# EAGLE design module_connector (EAGLE 9.6.2)
AUTHOR: Mike Schmidt; GENERATION: pasta; TITLE: Module Connector; VERSION: 04

## Sheet 1 of 2: Interface Connectors
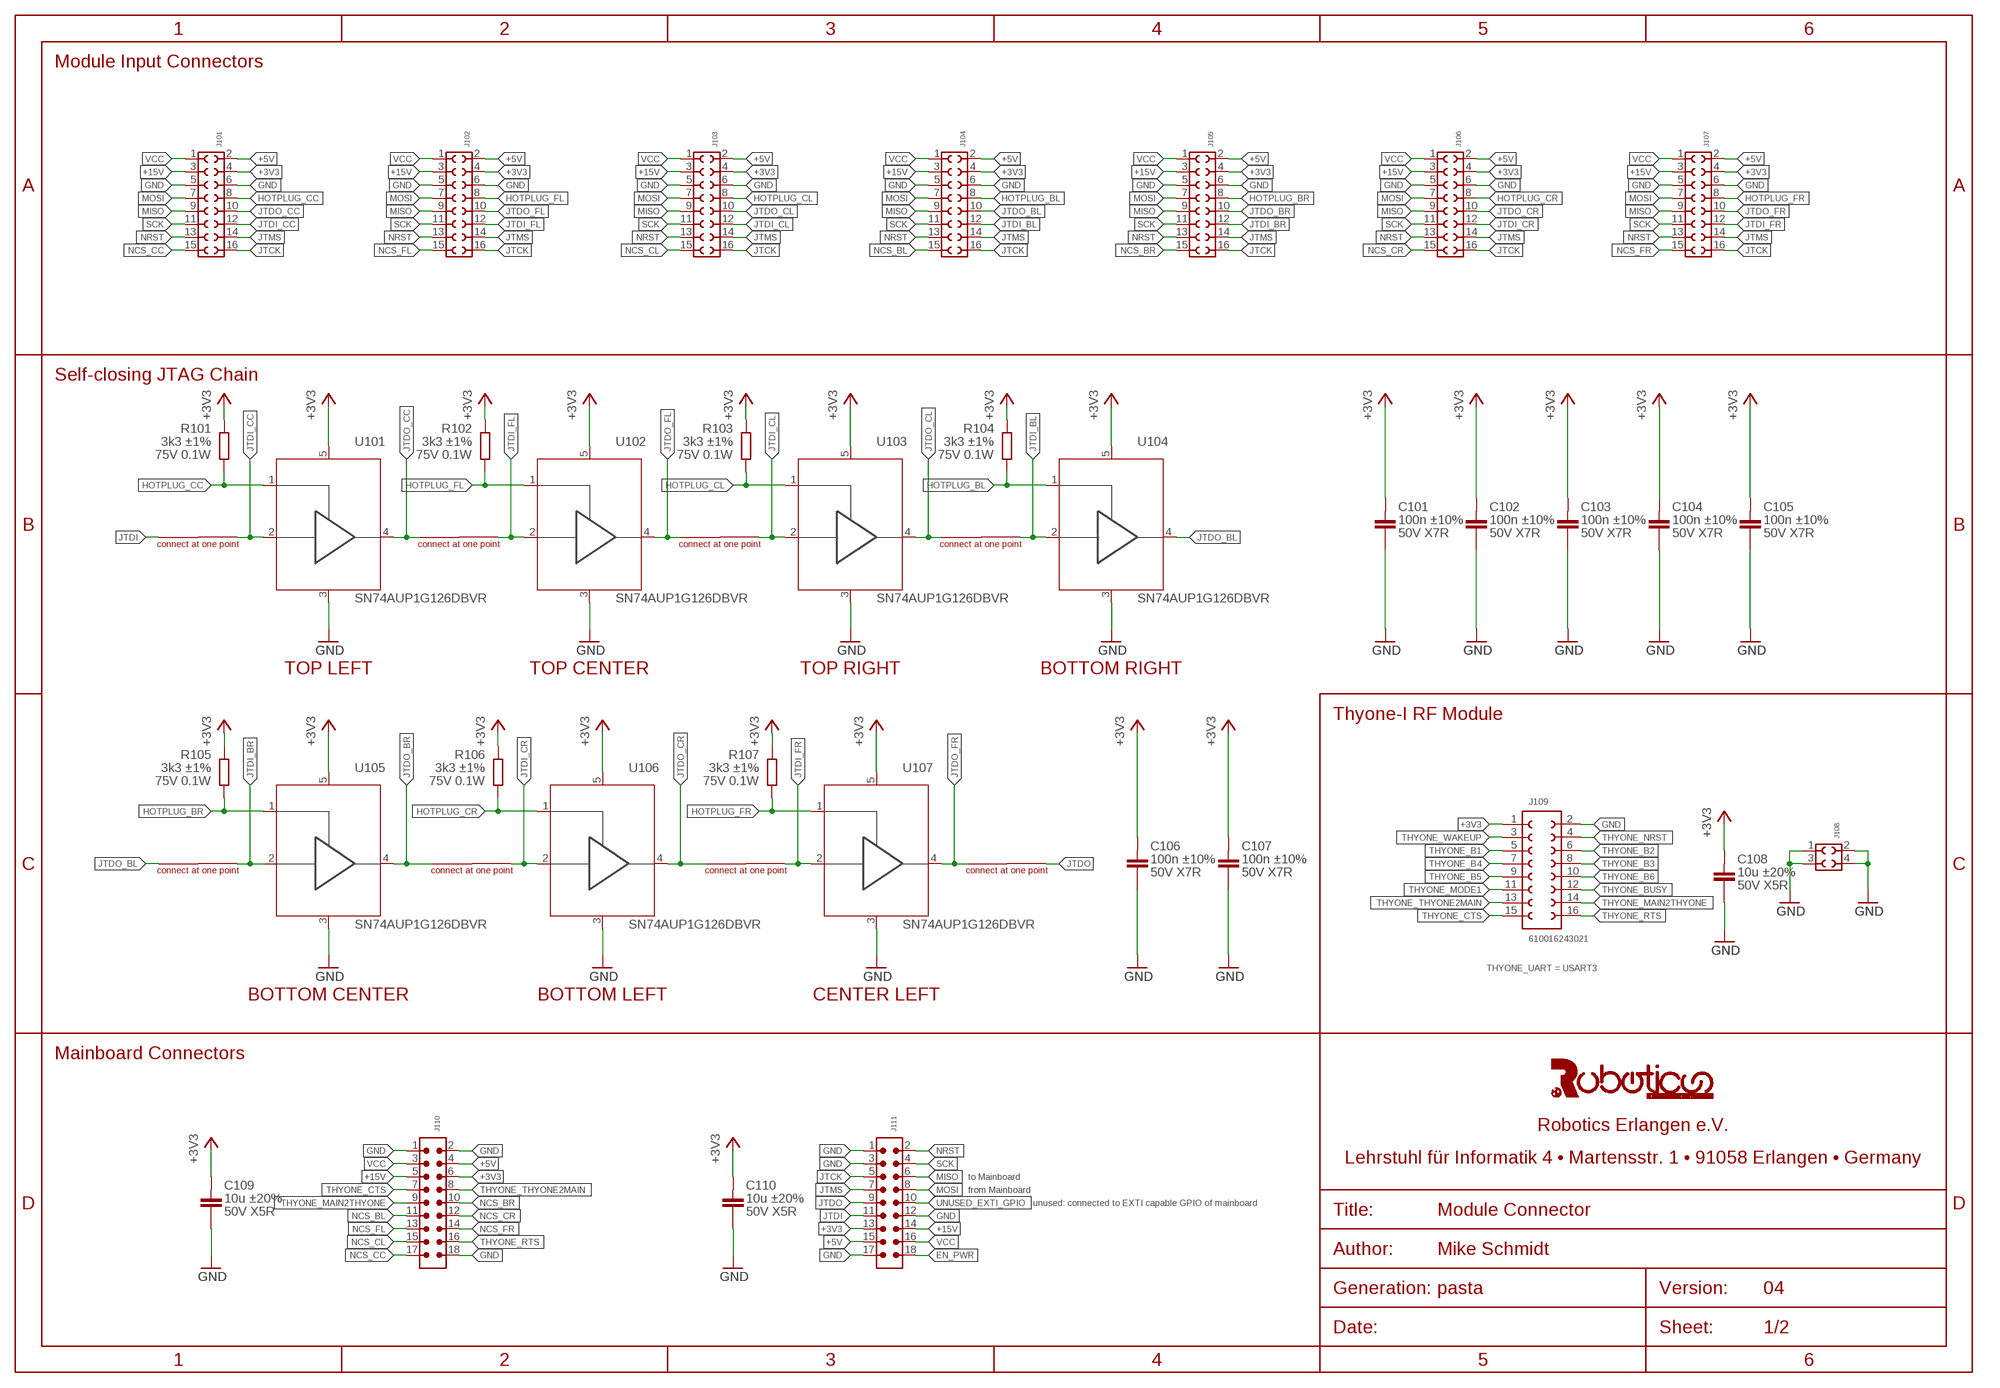
[diagram p0: schematic, sheet 1]

### Parts
C101  100n ±10% 50V X7R  C(100NF,50V,0603)  [C0603]
C102  100n ±10% 50V X7R  C(100NF,50V,0603)  [C0603]
C103  100n ±10% 50V X7R  C(100NF,50V,0603)  [C0603]
C104  100n ±10% 50V X7R  C(100NF,50V,0603)  [C0603]
C105  100n ±10% 50V X7R  C(100NF,50V,0603)  [C0603]
C106  100n ±10% 50V X7R  C(100NF,50V,0603)  [C0603]
C107  100n ±10% 50V X7R  C(100NF,50V,0603)  [C0603]
C108  10u ±20% 50V X5R  C(10UF,50V,1206)  [C1206]
C109  10u ±20% 50V X5R  C(10UF,50V,1206)  [C1206]
C110  10u ±20% 50V X5R  C(10UF,50V,1206)  [C1206]
J101  6100XX243021_610016243021  [610016243021]
J102  6100XX243021_610016243021  [610016243021]
J103  6100XX243021_610016243021  [610016243021]
J104  6100XX243021_610016243021  [610016243021]
J105  6100XX243021_610016243021  [610016243021]
J106  6100XX243021_610016243021  [610016243021]
J107  6100XX243021_610016243021  [610016243021]
J108  6100XX243021_610004243021  [610004243021]
J109  610016243021  [610X16243021]
J110  6130XX21121_61301821121  [61301821121]
J111  6130XX21121_61301821121  [61301821121]
R101  3k3 ±1% 75V 0.1W  R(3.3K,75V,0.1W,0603)  [R0603]
R102  3k3 ±1% 75V 0.1W  R(3.3K,75V,0.1W,0603)  [R0603]
R103  3k3 ±1% 75V 0.1W  R(3.3K,75V,0.1W,0603)  [R0603]
R104  3k3 ±1% 75V 0.1W  R(3.3K,75V,0.1W,0603)  [R0603]
R105  3k3 ±1% 75V 0.1W  R(3.3K,75V,0.1W,0603)  [R0603]
R106  3k3 ±1% 75V 0.1W  R(3.3K,75V,0.1W,0603)  [R0603]
R107  3k3 ±1% 75V 0.1W  R(3.3K,75V,0.1W,0603)  [R0603]
SHORT101  SHORT0.254  [SHORT0.254]
SHORT102  SHORT0.254  [SHORT0.254]
SHORT103  SHORT0.254  [SHORT0.254]
SHORT104  SHORT0.254  [SHORT0.254]
SHORT105  SHORT0.254  [SHORT0.254]
SHORT106  SHORT0.254  [SHORT0.254]
SHORT107  SHORT0.254  [SHORT0.254]
SHORT108  SHORT0.254  [SHORT0.254]
U101  SN74AUP1G126DBVR  [SOT23-5]
U102  SN74AUP1G126DBVR  [SOT23-5]
U103  SN74AUP1G126DBVR  [SOT23-5]
U104  SN74AUP1G126DBVR  [SOT23-5]
U105  SN74AUP1G126DBVR  [SOT23-5]
U106  SN74AUP1G126DBVR  [SOT23-5]
U107  SN74AUP1G126DBVR  [SOT23-5]

### Nets
+3V3: C101.1 C102.1 C103.1 C104.1 C105.1 C106.1 C107.1 C108.1 C109.1 C110.1 J101.4 J102.4 J103.4 J104.4 J105.4 J106.4 J107.4 J109.1 J110.6 J111.13 R101.2 R102.2 R103.2 R104.2 R105.2 R106.2 R107.2 U101.5(VCC) U102.5(VCC) U103.5(VCC) U104.5(VCC) U105.5(VCC) U106.5(VCC) U107.5(VCC)
+5V: J101.2 J102.2 J103.2 J104.2 J105.2 J106.2 J107.2 J110.4 J111.15
+15V: J101.3 J102.3 J103.3 J104.3 J105.3 J106.3 J107.3 J110.5 J111.14
EN_PWR: J111.18
GND: C101.2 C102.2 C103.2 C104.2 C105.2 C106.2 C107.2 C108.2 C109.2 C110.2 J101.5 J101.6 J102.5 J102.6 J103.5 J103.6 J104.5 J104.6 J105.5 J105.6 J106.5 J106.6 J107.5 J107.6 J108.1 J108.2 J108.3 J108.4 J109.2 J110.1 J110.2 J110.18 J111.1 J111.3 J111.12 J111.17 U101.3(GND) U102.3(GND) U103.3(GND) U104.3(GND) U105.3(GND) U106.3(GND) U107.3(GND)
HOTPLUG_BL: J104.8 R104.1 U104.1(OE)
HOTPLUG_BR: J105.8 R105.1 U105.1(OE)
HOTPLUG_CC: J101.8 R101.1 U101.1(OE)
HOTPLUG_CL: J103.8 R103.1 U103.1(OE)
HOTPLUG_CR: J106.8 R106.1 U106.1(OE)
HOTPLUG_FL: J102.8 R102.1 U102.1(OE)
HOTPLUG_FR: J107.8 R107.1 U107.1(OE)
JTCK: J101.16 J102.16 J103.16 J104.16 J105.16 J106.16 J107.16 J111.5
JTDI: J111.11 SHORT101.P1
JTDI_BL: J104.12 SHORT104.P2 U104.2(I)
JTDI_BR: J105.12 SHORT105.P2 U105.2(I)
JTDI_CC: J101.12 SHORT101.P2 U101.2(I)
JTDI_CL: J103.12 SHORT103.P2 U103.2(I)
JTDI_CR: J106.12 SHORT106.P2 U106.2(I)
JTDI_FL: J102.12 SHORT102.P2 U102.2(I)
JTDI_FR: J107.12 SHORT107.P2 U107.2(I)
JTDO: J111.9 SHORT108.P2
JTDO_BL: J104.10 SHORT105.P1 U104.4(O)
JTDO_BR: J105.10 SHORT106.P1 U105.4(O)
JTDO_CC: J101.10 SHORT102.P1 U101.4(O)
JTDO_CL: J103.10 SHORT104.P1 U103.4(O)
JTDO_CR: J106.10 SHORT107.P1 U106.4(O)
JTDO_FL: J102.10 SHORT103.P1 U102.4(O)
JTDO_FR: J107.10 SHORT108.P1 U107.4(O)
JTMS: J101.14 J102.14 J103.14 J104.14 J105.14 J106.14 J107.14 J111.7
MISO: J101.9 J102.9 J103.9 J104.9 J105.9 J106.9 J107.9 J111.6
MOSI: J101.7 J102.7 J103.7 J104.7 J105.7 J106.7 J107.7 J111.8
NCS_BL: J104.15 J110.11
NCS_BR: J105.15 J110.10
NCS_CC: J101.15 J110.17
NCS_CL: J103.15 J110.15
NCS_CR: J106.15 J110.12
NCS_FL: J102.15 J110.13
NCS_FR: J107.15 J110.14
NRST: J101.13 J102.13 J103.13 J104.13 J105.13 J106.13 J107.13 J111.2
SCK: J101.11 J102.11 J103.11 J104.11 J105.11 J106.11 J107.11 J111.4
THYONE_B1: J109.5
THYONE_B2: J109.6
THYONE_B3: J109.8
THYONE_B4: J109.7
THYONE_B5: J109.9
THYONE_B6: J109.10
THYONE_BUSY: J109.12
THYONE_CTS: J109.15 J110.7
THYONE_MAIN2THYONE: J109.14 J110.9
THYONE_MODE1: J109.11
THYONE_NRST: J109.4
THYONE_RTS: J109.16 J110.16
THYONE_THYONE2MAIN: J109.13 J110.8
THYONE_WAKEUP: J109.3
UNUSED_EXTI_GPIO: J111.10
VCC: J101.1 J102.1 J103.1 J104.1 J105.1 J106.1 J107.1 J110.3 J111.16

### Notes on the sheet
- Module Input Connectors
- Self-closing JTAG Chain
- TOP LEFT | TOP CENTER | TOP RIGHT | BOTTOM RIGHT
- Thyone-I RF Module
- THYONE_UART = USART3
- BOTTOM CENTER | BOTTOM LEFT | CENTER LEFT
- Mainboard Connectors
- to Mainboard
- from Mainboard
- unused: connected to EXTI capable GPIO of mainboard

## Sheet 2 of 2: Mechanical Components
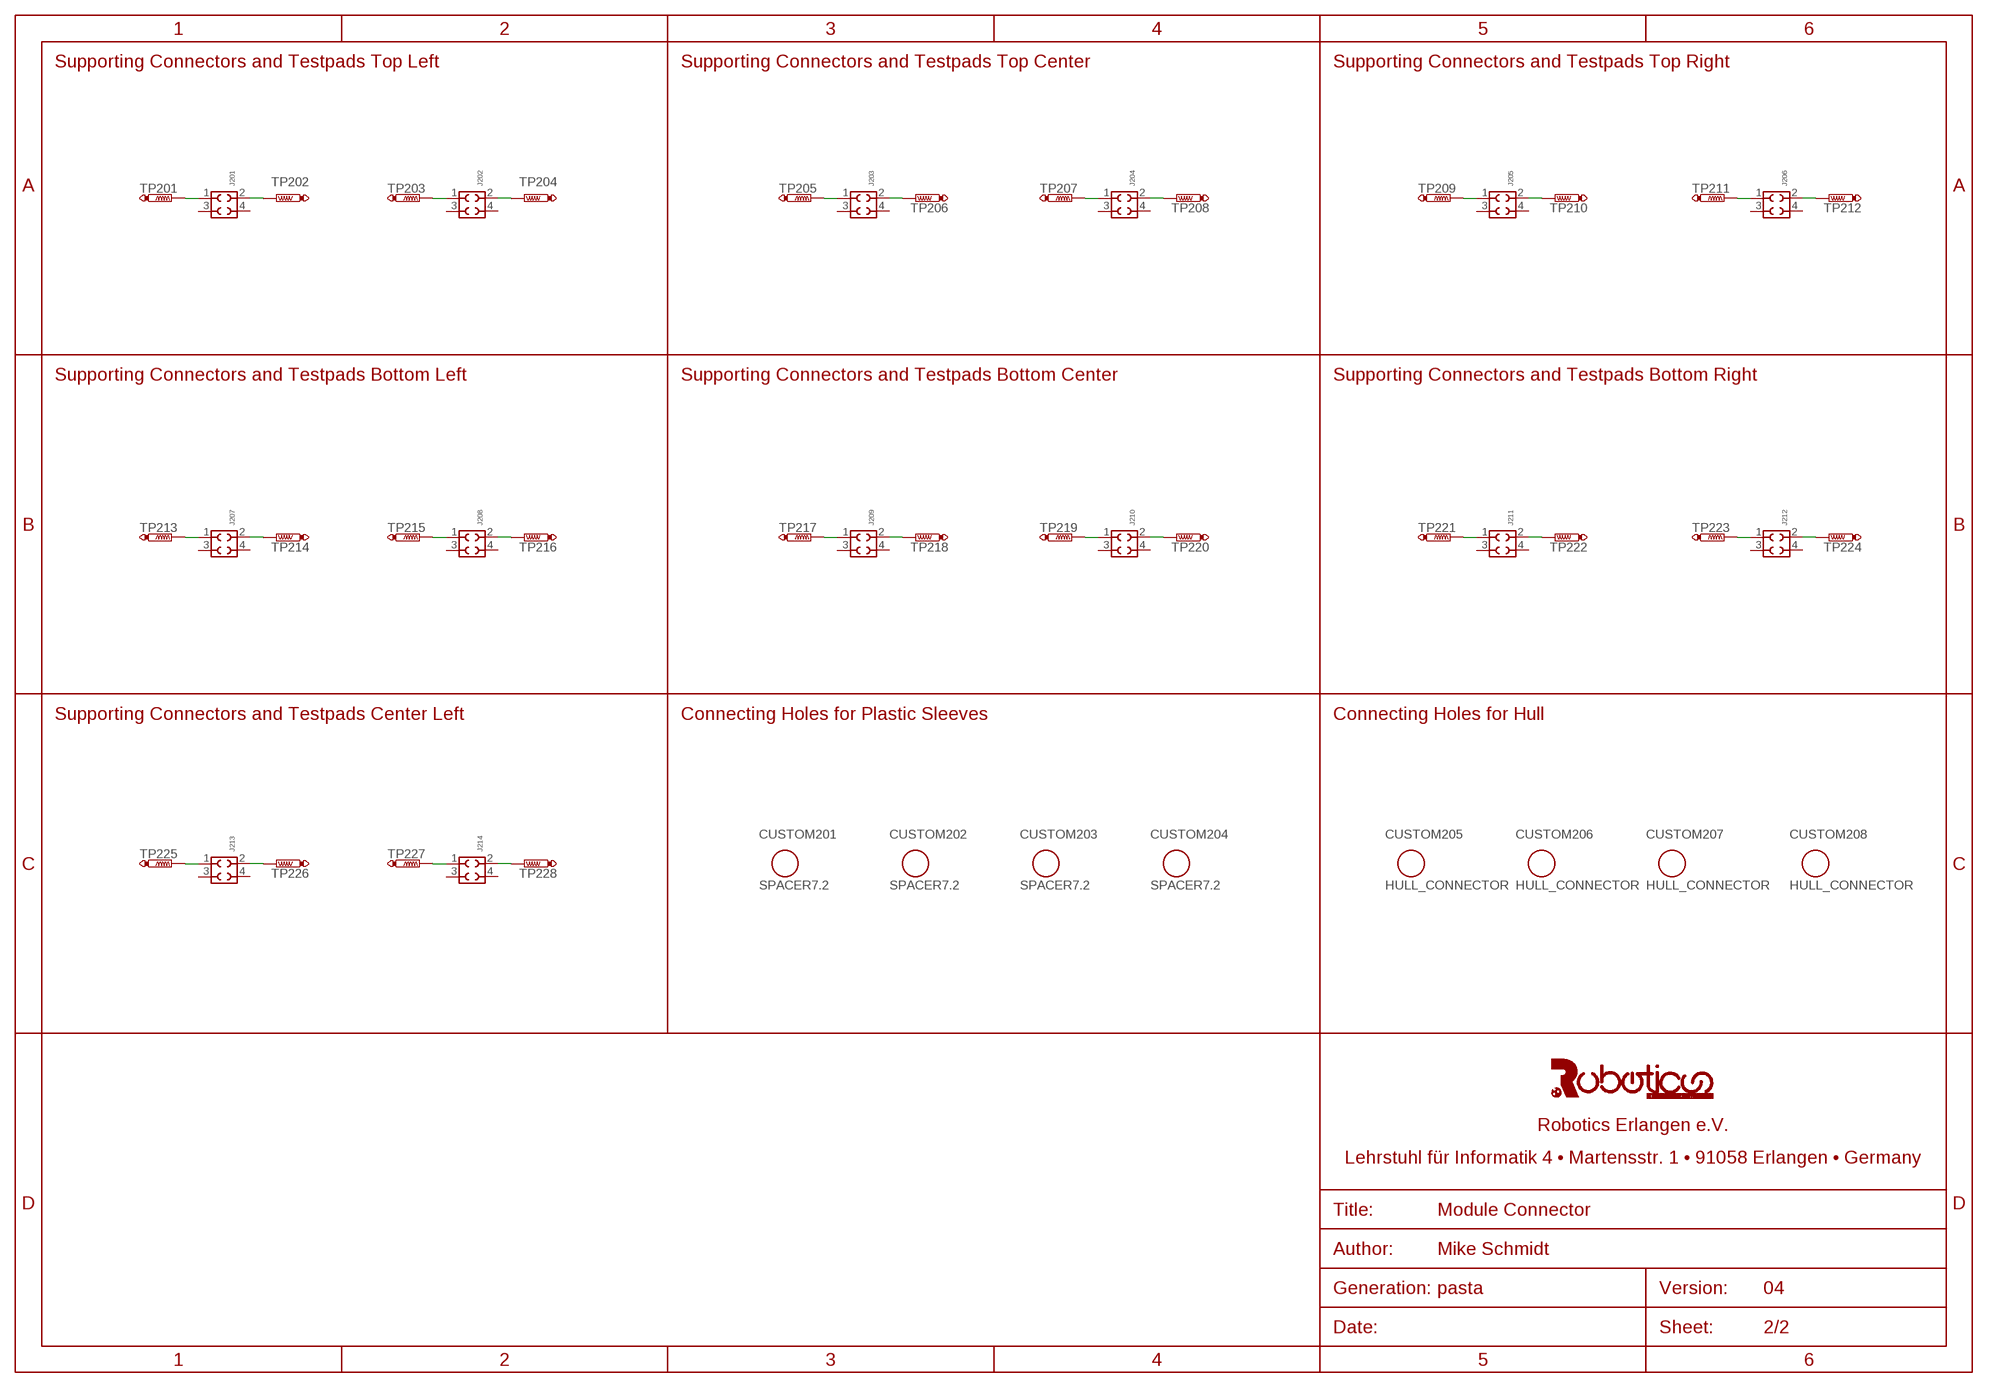
[diagram p1: schematic, sheet 2]

### Parts
CUSTOM201  SPACER7.2  [PLASTIC_SPACER]
CUSTOM202  SPACER7.2  [PLASTIC_SPACER]
CUSTOM203  SPACER7.2  [PLASTIC_SPACER]
CUSTOM204  SPACER7.2  [PLASTIC_SPACER]
CUSTOM205  HULL_CONNECTOR  [HULL_CONNECTOR]
CUSTOM206  HULL_CONNECTOR  [HULL_CONNECTOR]
CUSTOM207  HULL_CONNECTOR  [HULL_CONNECTOR]
CUSTOM208  HULL_CONNECTOR  [HULL_CONNECTOR]
J201  6100XX243021_610004243021  [610004243021]
J202  6100XX243021_610004243021  [610004243021]
J203  6100XX243021_610004243021  [610004243021]
J204  6100XX243021_610004243021  [610004243021]
J205  6100XX243021_610004243021  [610004243021]
J206  6100XX243021_610004243021  [610004243021]
J207  6100XX243021_610004243021  [610004243021]
J208  6100XX243021_610004243021  [610004243021]
J209  6100XX243021_610004243021  [610004243021]
J210  6100XX243021_610004243021  [610004243021]
J211  6100XX243021_610004243021  [610004243021]
J212  6100XX243021_610004243021  [610004243021]
J213  6100XX243021_610004243021  [610004243021]
J214  6100XX243021_610004243021  [610004243021]
TP201  TESTPAD  [TESTPAD]
TP202  TESTPAD  [TESTPAD]
TP203  TESTPAD  [TESTPAD]
TP204  TESTPAD  [TESTPAD]
TP205  TESTPAD  [TESTPAD]
TP206  TESTPAD  [TESTPAD]
TP207  TESTPAD  [TESTPAD]
TP208  TESTPAD  [TESTPAD]
TP209  TESTPAD  [TESTPAD]
TP210  TESTPAD  [TESTPAD]
TP211  TESTPAD  [TESTPAD]
TP212  TESTPAD  [TESTPAD]
TP213  TESTPAD  [TESTPAD]
TP214  TESTPAD  [TESTPAD]
TP215  TESTPAD  [TESTPAD]
TP216  TESTPAD  [TESTPAD]
TP217  TESTPAD  [TESTPAD]
TP218  TESTPAD  [TESTPAD]
TP219  TESTPAD  [TESTPAD]
TP220  TESTPAD  [TESTPAD]
TP221  TESTPAD  [TESTPAD]
TP222  TESTPAD  [TESTPAD]
TP223  TESTPAD  [TESTPAD]
TP224  TESTPAD  [TESTPAD]
TP225  TESTPAD  [TESTPAD]
TP226  TESTPAD  [TESTPAD]
TP227  TESTPAD  [TESTPAD]
TP228  TESTPAD  [TESTPAD]

### Nets
N$1: J201.1 TP201.P$1(TP)
N$2: J201.2 TP202.P$1(TP)
N$3: J203.1 TP205.P$1(TP)
N$4: J203.2 TP206.P$1(TP)
N$5: J202.1 TP203.P$1(TP)
N$6: J204.1 TP207.P$1(TP)
N$7: J202.2 TP204.P$1(TP)
N$8: J204.2 TP208.P$1(TP)
N$9: J205.1 TP209.P$1(TP)
N$10: J205.2 TP210.P$1(TP)
N$11: J206.1 TP211.P$1(TP)
N$12: J206.2 TP212.P$1(TP)
N$13: J207.1 TP213.P$1(TP)
N$14: J207.2 TP214.P$1(TP)
N$15: J208.1 TP215.P$1(TP)
N$16: J208.2 TP216.P$1(TP)
N$17: J209.1 TP217.P$1(TP)
N$18: J209.2 TP218.P$1(TP)
N$19: J210.1 TP219.P$1(TP)
N$20: J210.2 TP220.P$1(TP)
N$21: J211.1 TP221.P$1(TP)
N$22: J211.2 TP222.P$1(TP)
N$23: J212.1 TP223.P$1(TP)
N$24: J212.2 TP224.P$1(TP)
N$25: J213.1 TP225.P$1(TP)
N$26: J213.2 TP226.P$1(TP)
N$27: J214.1 TP227.P$1(TP)
N$28: J214.2 TP228.P$1(TP)
Unconnected: J201.3 J201.4 J202.3 J202.4 J203.3 J203.4 J204.3 J204.4 J205.3 J205.4 J206.3 J206.4 J207.3 J207.4 J208.3 J208.4 J209.3 J209.4 J210.3 J210.4 J211.3 J211.4 J212.3 J212.4 J213.3 J213.4 J214.3 J214.4

### Notes on the sheet
- Supporting Connectors and Testpads Top Left | Supporting Connectors and Testpads Top Center | Supporting Connectors and Testpads Top Right
- Supporting Connectors and Testpads Bottom Left | Supporting Connectors and Testpads Bottom Center | Supporting Connectors and Testpads Bottom Right
- Supporting Connectors and Testpads Center Left | Connecting Holes for Plastic Sleeves | Connecting Holes for Hull

## Library data of the parts
C101-C107 = capacitors:C(*?): Robotics Erlangen Capacitor Library This library provides a list of predefined capacitors with the following features: It is guaranteed that the capacitor exists with the given value, voltage rating and package size If you choose the capacitor you need (e.g. 2u2 with at least 50V) the package will be automatically choosen The manufacturer's data is automatically added so that exactly that capacitor will be ordered The value of the capacitor will be automatically filled with the most relevant data To choose a capacitor, you need to think about the voltage it must be rated for acc. to your application. Use below table to get a minimum voltage rating for the capacitor, depending on the maximum voltage that will be applied to it in your application. Maximum Voltage Applied Notes Minimum Voltage Rating ≤ 3.3V ≥ 6V3 ≤ 5.0V ≥ 10V ≤ 16.8V ≥ 25V ≤ 33.6V Includes all signals that are at max. VCC ≥ 50V After you determined the minimum voltage rating of the capacitor, search for it in the database of this library and choose the first one, that has at least that rating. The library is primarily sorted by capacitance values. Never change the value of predefined capacitors! Note: If your project requires a very specific capacitor (e.g. low tolerance, high voltage or E-24 upwards), then choose any of the predefined empty devices C(0402), C(0603), C(0805), C(1206), C(1210), or C(1812). Always set the attributes MF, MPN and VALUE for custom capacitors!; CAPACITANCE: 100n; DIELECTRIC: X7R; LINE1: 100n ±10%; LINE2: 50V X7R; MF: Würth Elektronik; MPN: 885012206095; TOLERANCE: ±10%; VOLTAGE: 50V
C108-C110 = capacitors:C(*?): Robotics Erlangen Capacitor Library This library provides a list of predefined capacitors with the following features: It is guaranteed that the capacitor exists with the given value, voltage rating and package size If you choose the capacitor you need (e.g. 2u2 with at least 50V) the package will be automatically choosen The manufacturer's data is automatically added so that exactly that capacitor will be ordered The value of the capacitor will be automatically filled with the most relevant data To choose a capacitor, you need to think about the voltage it must be rated for acc. to your application. Use below table to get a minimum voltage rating for the capacitor, depending on the maximum voltage that will be applied to it in your application. Maximum Voltage Applied Notes Minimum Voltage Rating ≤ 3.3V ≥ 6V3 ≤ 5.0V ≥ 10V ≤ 16.8V ≥ 25V ≤ 33.6V Includes all signals that are at max. VCC ≥ 50V After you determined the minimum voltage rating of the capacitor, search for it in the database of this library and choose the first one, that has at least that rating. The library is primarily sorted by capacitance values. Never change the value of predefined capacitors! Note: If your project requires a very specific capacitor (e.g. low tolerance, high voltage or E-24 upwards), then choose any of the predefined empty devices C(0402), C(0603), C(0805), C(1206), C(1210), or C(1812). Always set the attributes MF, MPN and VALUE for custom capacitors!; CAPACITANCE: 10u; DIELECTRIC: X5R; LINE1: 10u ±20%; LINE2: 50V X5R; MF: Samsung; MPN: CL31A106MBHNNNE; TOLERANCE: ±20%; VOLTAGE: 50V
CUSTOM201-CUSTOM204 = 2020-03_module_connector:SPACER7.2
CUSTOM205-CUSTOM208 = 2020-03_module_connector:HULL_CONNECTOR
J101-J107 = 2020-03_module_connector:6100XX243021_610016243021: WR-PHD 2.54 mm SMT Dual Socket Header Bottom Entry ARTICLE PROPERTIES: Pins:4;​ 6;​ 8;​ 10;​ 12;​ 16;​ 18;​ 20;​ 22;​ 24;​ 26;​ 32;​ 34 KIND PROPERTIES: Pitch：2.54 mm Quality Class:3 as per CECC 75 301-802 Rows：Dual Gender：Socket Header Type：Bottom Entry Large MATERIAL PROPERTIES: Insulator Material :PA6T Insulator Flammability Rating:UL94 V-0 Contact Material:Copper Alloy Contact Plating:Gold Contact Type:Stamped GENERAL INFORMATION Operating Temperature:-40 up to +125 °C Compliance:Lead free / RoHS ELECTRICAL PROPERTIES: Rated Current:3 A IR 1:3 A Withstanding Voltage:500 V (AC) Contact Resistance:20 mΩ RISO:1000 MΩ CERTIFICATION UL Approval:E323964 PACKAGING PROPERTIES Packaging:Tube <https://katalog.we-online.com/media/images/v2/o33207v209%20Family_WR-PHD_610xxx243021.jpg> Details see: https://katalog.we-online.com/en/em/PHD_2_54_SMT_DUAL_SOCKET_HEADER_BOTTOM_ENTRY_6100XX243021 Updated by Yingchun,Shan 2019-10-23 2019 (C) Würth Elektronik; MF: Würth Elektronik; MPN: 610016243021
J108 J201-J214 = 2020-03_module_connector:6100XX243021_610004243021: WR-PHD 2.54 mm SMT Dual Socket Header Bottom Entry ARTICLE PROPERTIES: Pins:4;​ 6;​ 8;​ 10;​ 12;​ 16;​ 18;​ 20;​ 22;​ 24;​ 26;​ 32;​ 34 KIND PROPERTIES: Pitch：2.54 mm Quality Class:3 as per CECC 75 301-802 Rows：Dual Gender：Socket Header Type：Bottom Entry Large MATERIAL PROPERTIES: Insulator Material :PA6T Insulator Flammability Rating:UL94 V-0 Contact Material:Copper Alloy Contact Plating:Gold Contact Type:Stamped GENERAL INFORMATION Operating Temperature:-40 up to +125 °C Compliance:Lead free / RoHS ELECTRICAL PROPERTIES: Rated Current:3 A IR 1:3 A Withstanding Voltage:500 V (AC) Contact Resistance:20 mΩ RISO:1000 MΩ CERTIFICATION UL Approval:E323964 PACKAGING PROPERTIES Packaging:Tube <https://katalog.we-online.com/media/images/v2/o33207v209%20Family_WR-PHD_610xxx243021.jpg> Details see: https://katalog.we-online.com/en/em/PHD_2_54_SMT_DUAL_SOCKET_HEADER_BOTTOM_ENTRY_6100XX243021 Updated by Yingchun,Shan 2019-10-23 2019 (C) Würth Elektronik; MF: Würth Elektronik; MPN: 610004243021
J109 = 2020-03_module_connector:610*16243021: 16-Pin Bottom Entry Connector from Würth Elektronik; MF: Würth Elektronik; MPN: 610016243021
J110 J111 = 2020-03_module_connector:6130XX21121_61301821121: WR-PHD 2.54 mm THT Dual Pin Header ARTICLE PROPERTIES: Pins:4;​ 6;​ 8;​ 10;​ 12;​ 14;​ 16;​ 18;​ 20;​ 22;​ 24;​ 26;​ 28;​ 30;​ 32;​ 34;​ 36;​ 40;​ 44;​ 64;​ 72;​ 80 KIND PROPERTIES: Pitch：2.54 mm Quality Class:3 as per CECC 75 301-802 Rows：Dual Gender：Pin Header Type：Board Stacker MATERIAL PROPERTIES: Insulator Material :PA6T Insulator Flammability Rating:UL94 V-0 Contact Material:Copper Alloy Contact Plating:Gold Contact Type:Stamped GENERAL INFORMATION Operating Temperature:-40 up to +105 °C Compliance:Lead free / RoHS ELECTRICAL PROPERTIES: Rated Current:3 A IR 1:3 A Withstanding Voltage:500 V (AC) Contact Resistance:20 mΩ RISO:1000 MΩ CERTIFICATION UL Approval:E323964 PACKAGING PROPERTIES Packaging:Bag <https://katalog.we-online.com/media/images/v2/o33215v209%20Family_WR-PHD_6130xx21121.jpg> Details see: https://katalog.we-online.com/en/em/PHD_2_54_THT_DUAL_PIN_HEADER_6130XX21121 Updated by Yingchun,Shan 2019-10-16 2019 (C) Würth Elektronik; MF: Würth Elektronik; MPN: 61301821121
R101-R107 = resistors:R(*?): Robotics Erlangen Resistor Library This library provides a list of predefined resistors with the following features: It is guaranteed that the resistor exists with the given value, voltage rating and package size If you choose the resistor you need (e.g. 10k with at least 75V and 0.1W) the package will be automatically choosen The manufacturer's data is automatically added so that exactly that resistor will be ordered The value of the resistor will be automatically filled with the most relevant data To choose a resistor, you have to determine the maximum operating voltage and power dissipation that will be applied to that resistor in your design. With these two values you can choose the minimum package acc. to below table, which lists the maximum operating voltage and power dissipation for each package. Always try to use a package with a voltage rating of at least twice your max. operating voltage and always keep a little marging between your power dissipation and the maximum power dissipation of the package (although typically, resistors can be overloaded by a factor of five for a short time period, i.e. less than a second). Package Maximum Operating Voltage Maximum Power Dissipation 0402 ≤ 50V ≤ 62.5 mW 0603 ≤ 75V ≤ 100 mW 0805 ≤ 150V ≤ 125 mW 1206 ≤ 200V ≤ 250 mW 1210 ≤ 200V ≤ 500 mW 2512 ≤ 200V ≤ 1 W Note: If your project requires a very specific resistor (e.g. low tolerance, high voltage / power dissipation or E-24 upwards), then choose any of the predefined empty devices R(0402), R(0603), R(0805), R(1206), R(1210), or R(2512). Always set the attributes MF, MPN and VALUE for custom resistors! Never change the value of non-custom resistors!; LINE1: 3k3 ±1%; LINE2: 75V 0.1W; MF: YAGEO; MPN: RC0603FR-073K3L; POWER: 0.1W; RESISTANCE: 3k3; TOLERANCE: ±1%; VOLTAGE: 75V
SHORT101-SHORT108 = 2020-03_module_connector:SHORT
TP201-TP228 = 2020-03_module_connector:TESTPAD
U101-U107 = 2020-03_module_connector:SN74AUP1G126DBV*; MF: Texas Instruments; MOUSER: 595-SN74AUP1G126DBVR; MPN: SN74AUP1G126DBVR

## Board
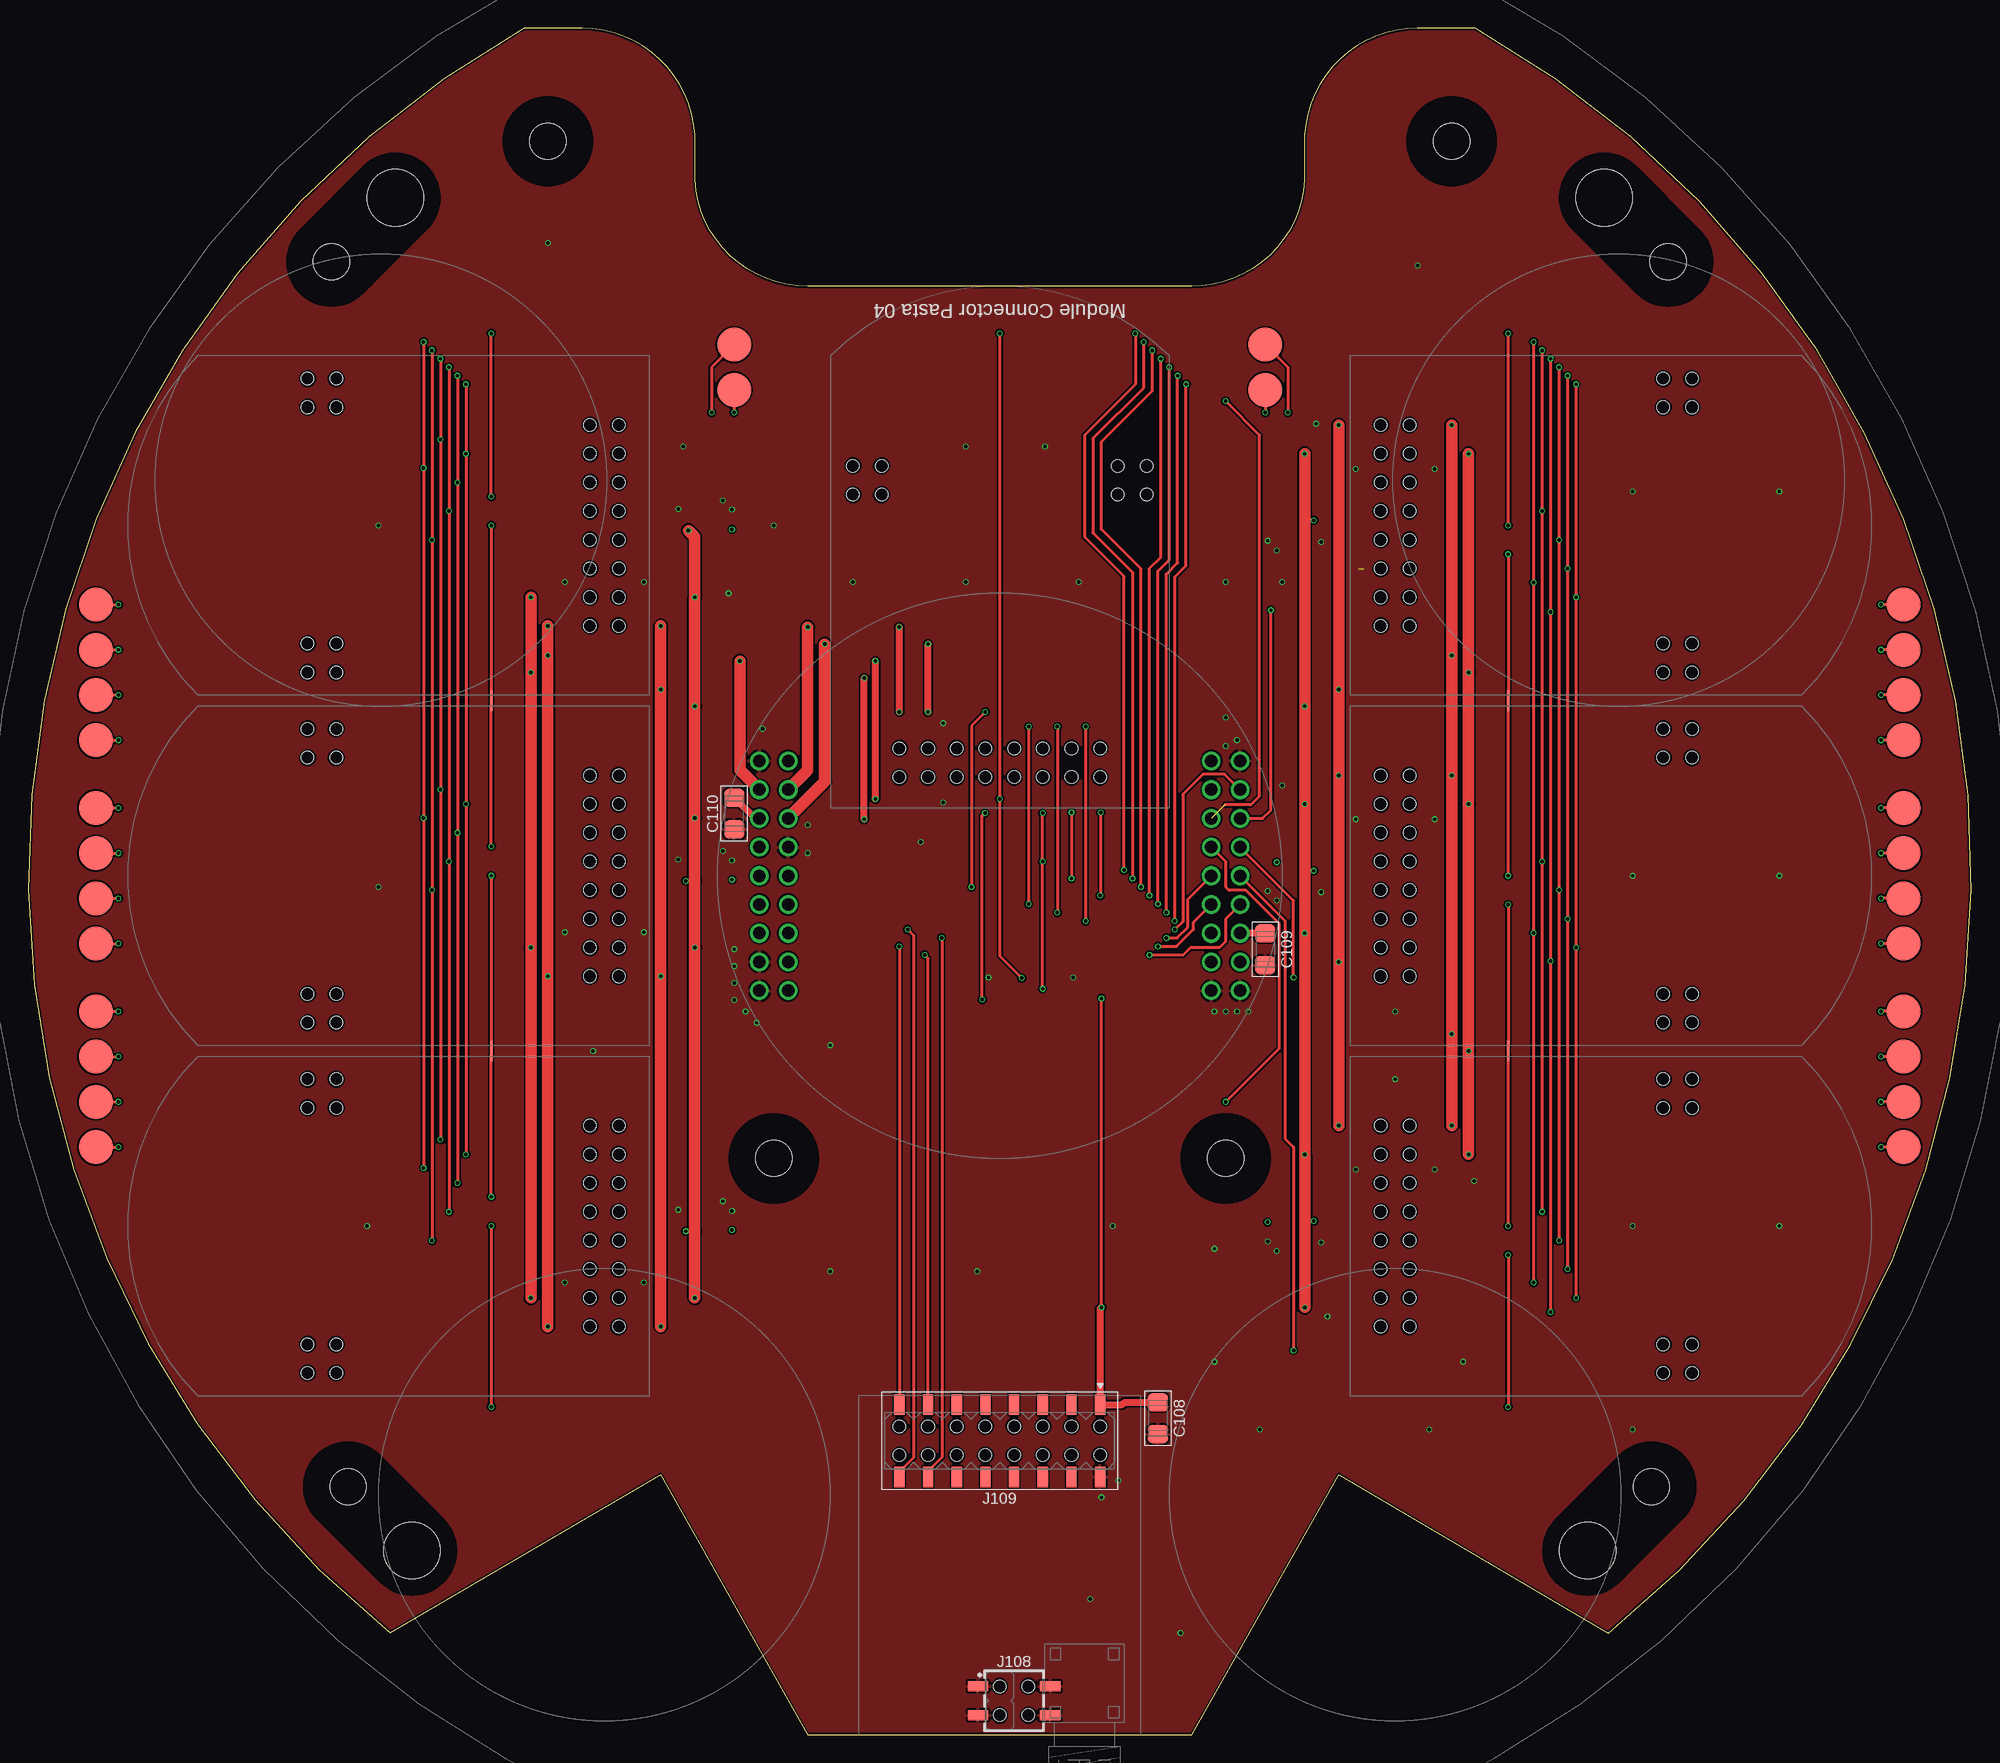
[diagram p2: board, top side]
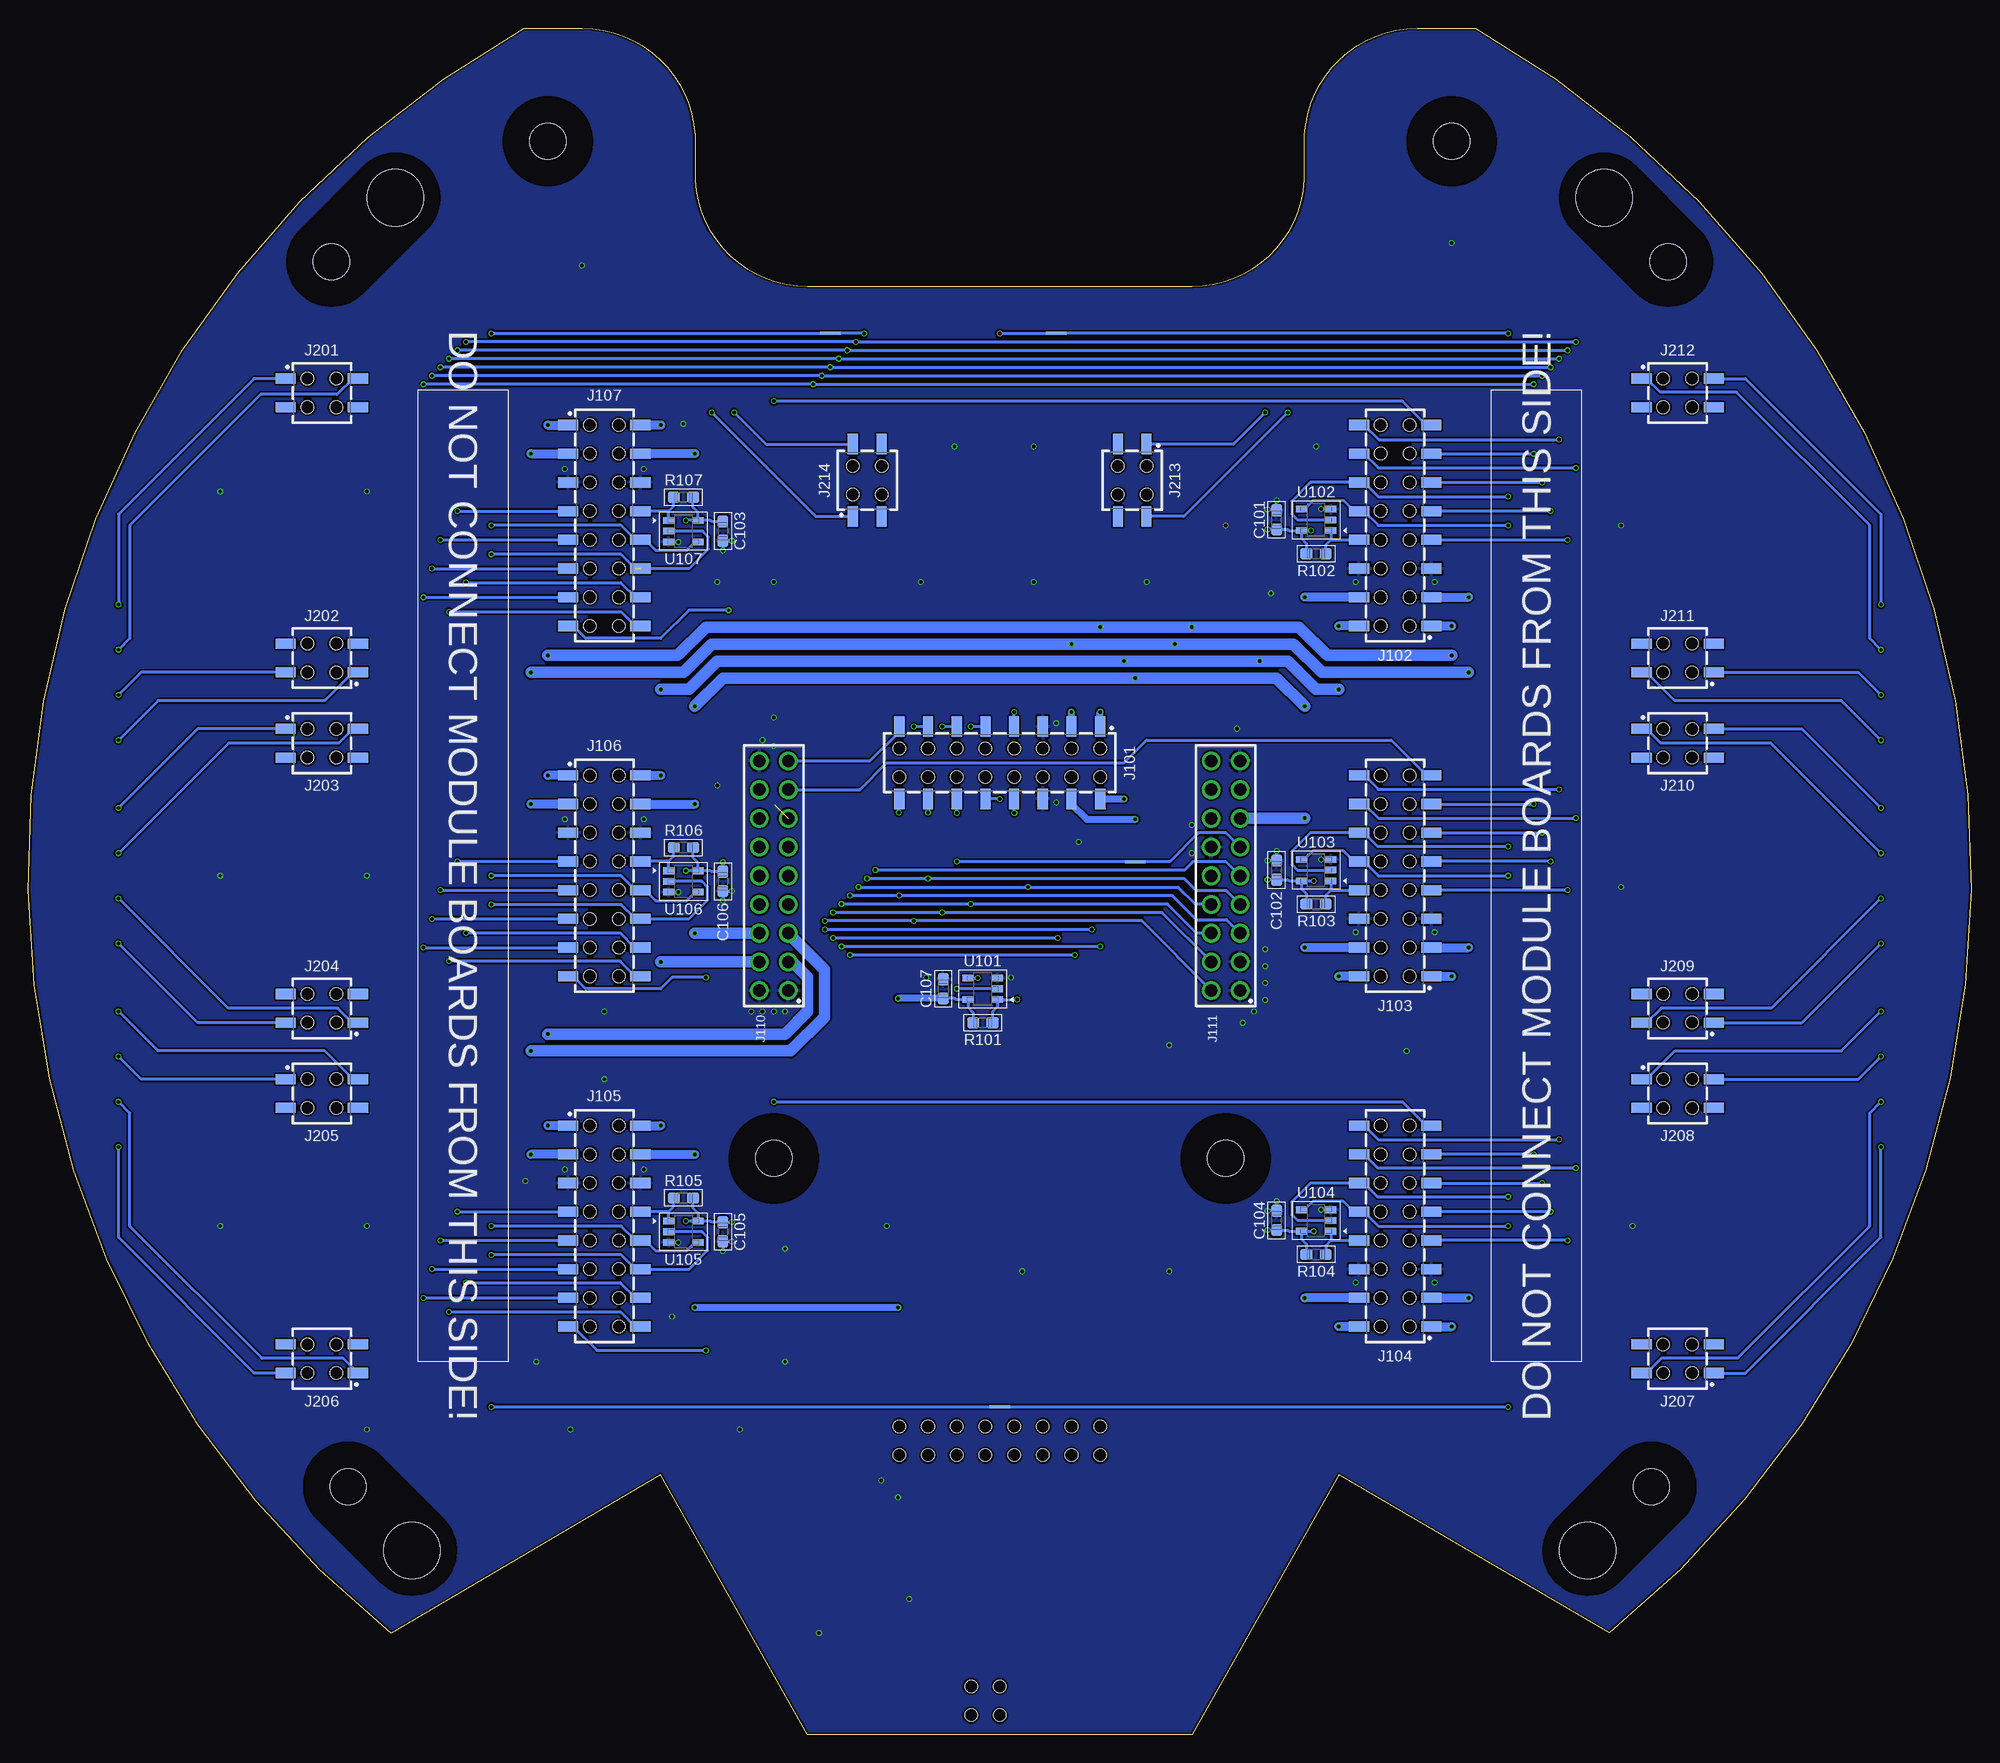
[diagram p3: board, bottom side, seen from below]

Size 171.98 x 151 mm. Coordinates in mm from the lower left corner, seen from the top.
Outline: 122.96,151 arc87 112.97,141.58 112.97,137.58 arc-87 102.99,128.16 68.99,128.16 arc-87 59.01,137.58 59.01,141.58 arc87 49.03,151 43.91,151 arc112 32.04,9.03 55.99,23 68.99,0 102.99,0 115.99,23 139.86,8.96 arc112 128.07,151 122.96,151
Copper layers (1*16): Top 0.035mm / dielectric 1.6mm / Bottom 0.035mm
Design rules "35u Robotics DRU No. 1 (6mil, 2 Layer, 0.3mm Drill)": minimum track width 6mil, minimum drill 0.3mm, track to track 6mil, track to pad 6mil, pad to pad 6mil, via to via 6mil, smd to smd 0mil, copper to edge 0.2mm, drill to drill 6mil, minimum pad ring 0.1mm, minimum via ring 0.1mm, stop-mask expansion 0.05mm, vias tented up to drill 0.45mm, thermal gap 0.2mm

### Footprints (pad centres in the part's own frame; a part is rotated, then mirrored left to right if it is on the bottom)
C0603 = smd 1.1 x 1: 1 -0.85,0; 2 0.85,0
C1206 = smd 1.6 x 1.8: 1 -1.4,0; 2 1.4,0
PLASTIC_SPACER = hole 5: 0,0 | hole 3.2: 8,0
HULL_CONNECTOR = hole 3.2: 0,0
610016243021 = smd 0.9 x 1.8: 1 -8.89,-3.2; 2 -8.89,3.2; 3 -6.35,-3.2; 4 -6.35,3.2; 5 -3.81,-3.2; 6 -3.81,3.2; 7 -1.27,-3.2; 8 -1.27,3.2; 9 1.27,-3.2; 10 1.27,3.2; 11 3.81,-3.2; 12 3.81,3.2; 13 6.35,-3.2; 14 6.35,3.2; 15 8.89,-3.2; 16 8.89,3.2 | hole 1.1: -8.89,1.27; -6.35,1.27; -6.35,-1.27; -8.89,-1.27; -3.81,1.27; -3.81,-1.27; -1.27,1.27; -1.27,-1.27; 1.27,-1.27; 1.27,1.27; 3.81,1.27; 3.81,-1.27; 6.35,-1.27; 6.35,1.27; 8.89,1.27; 8.89,-1.27
610004243021 = smd 0.9 x 1.8: 1 -1.27,-3.2; 2 -1.27,3.2; 3 1.27,-3.2; 4 1.27,3.2 | hole 1.1: -1.27,1.27; -1.27,-1.27; 1.27,1.27; 1.27,-1.27
610X16243021 = smd 0.9 x 1.8: 1 -8.89,-3.2; 2 -8.89,3.2; 3 -6.35,-3.2; 4 -6.35,3.2; 5 -3.81,-3.2; 6 -3.81,3.2; 7 -1.27,-3.2; 8 -1.27,3.2; 9 1.27,-3.2; 10 1.27,3.2; 11 3.81,-3.2; 12 3.81,3.2; 13 6.35,-3.2; 14 6.35,3.2; 15 8.89,-3.2; 16 8.89,3.2 | hole 1.1: -8.89,1.27; -6.35,1.27; -6.35,-1.27; -8.89,-1.27; -3.81,1.27; -3.81,-1.27; -1.27,1.27; -1.27,-1.27; 1.27,-1.27; 1.27,1.27; 3.81,1.27; 3.81,-1.27; 6.35,-1.27; 6.35,1.27; 8.89,1.27; 8.89,-1.27
61301821121 = drill 1.1: 1 -10.16,-1.27; 2 -10.16,1.27; 3 -7.62,-1.27; 4 -7.62,1.27; 5 -5.08,-1.27; 6 -5.08,1.27; 7 -2.54,-1.27; 8 -2.54,1.27; 9 0,-1.27; 10 0,1.27; 11 2.54,-1.27; 12 2.54,1.27; 13 5.08,-1.27; 14 5.08,1.27; 15 7.62,-1.27; 16 7.62,1.27; 17 10.16,-1.27; 18 10.16,1.27
R0603 = smd 1.1 x 1: 1 -0.85,0; 2 0.85,0
SHORT0.254 = smd 1 x 0.254: P1 -0.4,0; P2 0.4,0
TESTPAD = smd 3 x 3: P$1 0,0
SOT23-5 = smd 1.1 x 0.6: 1 -1.3,0.95; 2 -1.3,0; 3 -1.3,-0.95; 4 1.3,-0.95; 5 1.3,0.95

### Placement (x,y rotation side)
C101  61.49,107.5 90 bottom
C102  61.49,76.5 90 bottom
C103  110.49,106.5 270 bottom
C104  61.49,45.5 90 bottom
C105  110.49,44.5 270 bottom
C106  110.49,75.5 270 bottom
C107  90.99,66 90 bottom
C108  99.99,28 270 top
C109  109.49,69.5 270 top
C110  62.49,81.5 270 top
CUSTOM201  33.97,16.28 135 top
CUSTOM202  139.49,136 315 top
CUSTOM203  32.49,136 225 top
CUSTOM204  138.01,16.28 45 top
CUSTOM205  125.99,141 270 top
CUSTOM206  45.99,141 270 top
CUSTOM207  105.99,51 270 top
CUSTOM208  65.99,51 270 top
J101  85.99,86 180 bottom
J102  50.99,107 90 bottom
J103  50.99,76 90 bottom
J104  50.99,45 90 bottom
J105  120.99,45 270 bottom
J106  120.99,76 270 bottom
J107  120.99,107 270 bottom
J108  87.26,3 270 top
J109  85.99,26 180 top
J110  105.99,76 90 bottom
J111  65.99,76 90 bottom
J201  145.99,118.73 270 bottom
J202  145.99,95.27 90 bottom
J203  145.99,87.73 270 bottom
J204  145.99,64.27 90 bottom
J205  145.99,56.73 270 bottom
J206  145.99,33.27 90 bottom
J207  25.99,33.27 90 bottom
J208  25.99,56.73 270 bottom
J209  25.99,64.27 90 bottom
J210  25.99,87.73 270 bottom
J211  25.99,95.27 90 bottom
J212  25.99,118.73 270 bottom
J213  74.26,111 180 bottom
J214  97.72,111 0 bottom
R101  87.49,63 180 bottom
R102  57.99,104.5 180 bottom
R103  57.99,73.5 180 bottom
R104  57.99,42.5 180 bottom
R105  113.99,47.5 0 bottom
R106  113.99,78.5 0 bottom
R107  113.99,109.5 0 bottom
SHORT101  73.99,77.25 180 bottom
SHORT102  80.99,124 0 bottom
SHORT103  40.99,91.5 270 top
SHORT104  40.99,60.5 270 top
SHORT105  85.99,29 180 bottom
SHORT106  130.99,60.5 90 top
SHORT107  130.99,91.5 90 top
SHORT108  100.99,124 0 bottom
TP201  165.99,100 270 top
TP202  165.99,96 270 top
TP203  165.99,88 270 top
TP204  165.99,92 270 top
TP205  165.99,82 0 top
TP206  165.99,78 0 top
TP207  165.99,74 0 top
TP208  165.99,70 0 top
TP209  165.99,60 0 top
TP210  165.99,64 0 top
TP211  165.99,56 0 top
TP212  165.99,52 0 top
TP213  5.99,52 0 top
TP214  5.99,56 0 top
TP215  5.99,64 0 top
TP216  5.99,60 0 top
TP217  5.99,70 0 top
TP218  5.99,74 0 top
TP219  5.99,78 0 top
TP220  5.99,82 0 top
TP221  5.99,92 0 top
TP222  5.99,88 0 top
TP223  5.99,96 0 top
TP224  5.99,100 0 top
TP225  62.49,119 0 top
TP226  62.49,123 180 top
TP227  109.49,123 0 top
TP228  109.49,119 180 top
U101  87.49,66 180 bottom
U102  57.99,107.5 180 bottom
U103  57.99,76.5 180 bottom
U104  57.99,45.5 180 bottom
U105  113.99,44.5 0 bottom
U106  113.99,75.5 0 bottom
U107  113.99,106.5 0 bottom
U$1  [MODULE_BOARD]  85.99,86 180 top
U$2  [HULL]  85.99,76 270 top
U$3  [RF-MODULE]  85.99,30 180 top
U$13  [MODULE_BOARD]  120.99,107 90 top
U$15  [MODULE_BOARD]  120.99,76 90 top
U$16  [LOGO]  8.99,76 270 top
U$17  [LOGO]  162.99,76 90 top
U$20  [MODULE_BOARD]  120.99,45 90 top
U$21  [MODULE_BOARD]  50.99,45 270 top
U$22  [MODULE_BOARD]  50.99,76 270 top
U$23  [MODULE_BOARD]  50.99,107 270 top

### Tracks (layer width: path | path; a pad name or v marks a point on that pad's centre or on a via)
+3V3  (via drill 0.3)
  Top 0.254: v113.79,107.45 112.99,107.45 | v113.79,76.45 112.99,76.45 | v113.79,45.45 112.99,45.45 | v58.19,44.55 58.99,44.55 | v58.19,75.55 58.99,75.55 | v94.99,37.8 v94.99,65.15
  Top 0.61: v73.99,81 v73.99,93.5 | v94.99,37.8 94.88,37.69 J109.1 96.84,29.2 97.04,29.4 C108.1 | C110.1 64.31,81.08 J111.13 | C109.1 107.28,70.9 J110.6
  Top 1.016: v58.99,38.65 58.99,44.55 v58.99,69.65 58.99,75.55 v58.99,81.1 v58.99,91 v58.99,100.65 58.99,106 v58.44,106.55 | v112.99,113.35 112.99,107.45 v112.99,91 v112.99,82.35 112.99,76.45 v112.99,70.92 v112.99,51.35 112.99,45.45 v112.99,37.8
  Bottom 0.254: U107.5 112.69,108.15 113.14,108.6 R107.2 | R105.2 113.14,46.6 112.69,46.15 U105.5 | U104.5 59.29,43.85 58.84,43.4 R104.2 | U103.5 59.29,74.85 58.84,74.4 R103.2 | U102.5 59.29,105.85 58.84,105.4 R102.2 | U106.5 112.69,77.15 113.14,77.6 R106.2 | v62.29,106.65 C101.1 60.49,106.65 60.39,106.55 U102.5 | v62.29,75.65 C102.1 60.49,75.65 60.39,75.55 U103.5 | v62.29,44.65 C104.1 60.49,44.65 60.39,44.55 U104.5 | v109.69,45.35 C105.1 111.49,45.35 111.59,45.45 U105.5 | v110.49,77.2 C106.1 111.49,76.35 111.59,76.45 U106.5 | C103.1 111.49,107.35 111.59,107.45 U107.5 | U107.5 v113.79,107.45 | U106.5 v113.79,76.45 | U105.5 v113.79,45.45 | U104.5 v58.19,44.55 | U103.5 v58.19,75.55 | U102.5 v58.44,106.55 | C107.1 89.99,65.15 89.89,65.05 U101.5 88.79,64.35 88.34,63.9 R101.2
  Bottom 0.61: J101.4 79.64,82.35 78.29,81 v73.99,81 | v112.99,37.8 v94.99,37.8 | C107.1 v94.99,65.15
  Bottom 0.813: J102.4 v58.99,100.65 | J104.4 v58.99,38.65 | J103.4 v58.99,69.65 | v112.99,113.35 J107.4 | J105.4 v112.99,51.35 | J106.4 v112.99,82.35
  Bottom 1.016: v58.99,91 61.49,93.5 v73.99,93.5 110.49,93.5 v112.99,91 | J110.6 v112.99,70.92 | J111.13 59.01,81.08 v58.99,81.1
+5V  (via drill 0.3)
  Top 0.61: v74.99,82.8 v74.99,95
  Top 1.016: v55.99,98.11 v55.99,92.5 v55.99,67.11 v55.99,36.11 | v115.99,53.89 v115.99,68.38 v115.99,84.89 v115.99,92.5 v115.99,115.89 | J111.15 62.99,85.35 v62.99,95
  Bottom 0.61: J101.2 v74.99,82.8
  Bottom 0.813: J102.2 v55.99,98.11 | J104.2 v55.99,36.11 | J103.2 v55.99,67.11 | v115.99,115.89 J107.2 | J105.2 v115.99,53.89 | J106.2 v115.99,84.89
  Bottom 1.016: v55.99,92.5 57.99,92.5 60.49,95 v62.99,95 v74.99,95 110.99,95 113.49,92.5 v115.99,92.5 | J110.4 v115.99,68.38
+15V  (via drill 0.3)
  Top 0.61: v79.64,90.5 v79.64,96.5
  Top 1.016: v44.49,100.65 v44.49,94 v44.49,69.65 v44.49,38.65 | v127.49,51.35 v127.49,60.5 v127.49,82.35 v127.49,94 v127.49,113.35 | J111.14 70.49,84.31 v70.49,96.5
  Bottom 0.61: J101.3 v79.64,90.5
  Bottom 0.813: J102.3 v44.49,100.65 | J103.3 v44.49,69.65 | J104.3 v44.49,38.65 | v127.49,113.35 J107.3 | J105.3 v127.49,51.35 | J106.3 v127.49,82.35
  Bottom 1.016: v44.49,94 57.49,94 59.99,96.5 v70.49,96.5 v79.64,96.5 111.49,96.5 113.99,94 v127.49,94 | J110.5 101.49,67.69 101.49,63.5 104.49,60.5 v127.49,60.5
GND  (via drill 0.3, 0.35)
  Bottom 0.254: v109.69,105.65 C103.2 v110.49,104.8 | v110.49,73.8 C106.2 v109.69,74.65 | v110.49,42.8 C105.2 v109.69,43.65 | v61.49,47.2 C104.2 v62.29,46.35 | v61.49,78.2 C102.2 v62.29,77.35 | v61.49,109.2 C101.2 61.54,108.4 v62.29,108.4 | U106.3 v114.44,74.55 | U107.3 v114.44,105.55 | U105.3 v114.44,43.55 | U104.3 v57.54,46.45 | U103.3 v57.54,77.45 | U102.3 v57.54,108.45
  other vias: 57.99,114 65.99,107 61.99,101 72.99,102 82.99,102 92.99,102 82.99,114 89.99,114 105.99,102 105.99,90 110.99,84 110.99,102 113.99,116 122.99,130 141.99,110 141.99,76 154.99,110 154.99,76 141.99,45 154.99,45 141.99,27 123.99,27 127.99,49 120.99,64 120.99,58 108.99,27 104.99,33 104.99,43 114.99,37 126.99,33 95.99,45 92.49,67 70.99,41 70.99,61 78.99,79 49.99,60.5 29.99,45 30.99,75 30.99,107 45.99,132 101.99,9 93.99,12 94.99,21 96.49,22.5 54.49,71 47.49,71 47.49,102 54.49,102 54.49,40 47.49,40 117.49,50 124.49,50 117.49,81 124.49,81 117.49,112 124.49,112 80.99,89.5 80.99,82.5 106.99,88 105.99,87.5 104.99,64 105.99,64 106.99,64 107.99,64 64.49,63 62.49,65 62.49,66.5 62.49,68 62.49,69.5 68.99,78 68.99,80.5 63.49,64 83.99,41 84.99,67 64.99,89
  pour Top: 85.99,166 arc-90 175.99,76 arc-90 85.99,-14 arc-90 -4.01,76 arc-90
  pour Bottom: 85.99,166 arc-90 175.99,76 arc-90 85.99,-14 arc-90 -4.01,76 arc-90
HOTPLUG_BL
  Bottom 0.254: 56.69,43.73 J104.8 | U104.1 56.69,43.73 | 56.69,43.73 57.14,43.28 R104.1
HOTPLUG_BR
  Bottom 0.254: U105.1 115.29,46.27 | 115.29,46.27 J105.8 | 115.29,46.27 114.84,46.72 R105.1
HOTPLUG_CC  (via drill 0.3)
  Top 0.254: v84.44,65.05 84.44,81.3 v84.69,81.55
  Bottom 0.254: v84.44,65.05 U101.1 86.19,64.4 86.64,63.95 R101.1 | v84.69,81.55 84.72,81.58 J101.8
HOTPLUG_CL
  Bottom 0.254: U103.1 56.69,74.73 | 56.69,74.73 J103.8 | R103.1 57.14,74.28 56.69,74.73
HOTPLUG_CR
  Bottom 0.254: U106.1 115.29,77.27 | 115.29,77.27 J106.8 | 115.29,77.27 114.84,77.72 R106.1
HOTPLUG_FL
  Bottom 0.254: U102.1 56.69,105.73 | 56.69,105.73 J102.8 | R102.1 57.14,105.28 56.69,105.73
HOTPLUG_FR
  Bottom 0.254: U107.1 115.29,108.27 | 115.29,108.27 J107.8 | 115.29,108.27 114.84,108.72 R107.1
JTCK  (via drill 0.3)
  Top 0.254: v36.49,121.75 v36.49,114.6 v36.49,83.65 v36.49,52.65 | v134.74,121.75 v134.74,99.35 v134.74,68.45 v134.74,37.4 | v94.88,74.25 94.93,74.3 v94.93,81.6 | v99.24,74.25 99.24,103.2 100.24,104.2 v100.24,121.75
  Bottom 0.254: J111.5 65.92,72.12 68.57,72.12 70.7,74.25 v94.88,74.25 v99.24,74.25 | v36.49,121.75 v100.24,121.75 v134.74,121.75 | J107.16 118.25,98.11 119.49,99.35 v134.74,99.35 | J106.16 118.25,67.11 119.59,68.45 v134.74,68.45 | J105.16 118.25,36.11 119.54,37.4 v134.74,37.4 | J102.16 53.74,115.89 52.45,114.6 v36.49,114.6 | J103.16 53.73,84.89 52.49,83.65 v36.49,83.65 | J104.16 53.73,53.89 52.49,52.65 v36.49,52.65 | J101.16 94.93,82.75 v94.93,81.6
JTDI
  Bottom 0.254: J111.11 65.98,79.8 68.39,79.8 70.94,77.25 SHORT101.P1
JTDI_BL  (via drill 0.3)
  Top 0.254: v40.99,47.6 SHORT104.P2
  Bottom 0.254: v40.99,47.6 52.54,47.6 53.75,48.81 J104.12 58.48,48.81 60.14,47.15 60.14,46 59.64,45.5 U104.2
JTDI_BR  (via drill 0.3)
  Top 0.254: v130.99,42.45 v130.99,29
  Bottom 0.254: v130.99,29 SHORT105.P2 | v130.99,42.45 119.49,42.45 118.23,41.19 J105.12 113.5,41.19 111.84,42.85 111.84,44 112.34,44.5 U105.2
JTDI_CC  (via drill 0.3)
  Top 0.254: v89.79,81.55 v89.79,77.25 v89.79,66
  Bottom 0.254: SHORT101.P2 v89.79,77.25 | v89.79,81.55 J101.12 | U101.2 v89.79,66
JTDI_CL  (via drill 0.3)
  Top 0.254: v40.99,78.6 SHORT103.P2
  Bottom 0.254: v40.99,78.6 52.54,78.6 53.75,79.81 J103.12 58.48,79.81 60.14,78.15 60.14,77 59.64,76.5 U103.2
JTDI_CR  (via drill 0.3)
  Top 0.254: v130.99,73.45 SHORT106.P2
  Bottom 0.254: v130.99,73.45 119.49,73.45 118.23,72.19 J106.12 113.5,72.19 111.84,73.85 111.84,75 112.34,75.5 U106.2
JTDI_FL  (via drill 0.3)
  Top 0.254: v40.99,109.55 v40.99,124
  Bottom 0.254: v40.99,124 SHORT102.P2 | v40.99,109.55 52.49,109.55 53.75,110.81 J102.12 58.48,110.81 60.14,109.15 60.14,108 59.64,107.5 U102.2
JTDI_FR  (via drill 0.3)  (1 unrouted)
  Top 0.254: v130.99,104.45 SHORT107.P2
  Bottom 0.254: 118.23,103.19 119.49,104.45 v130.99,104.45 | U107.2 112.29,106.5 111.79,106 111.79,104.9 113.5,103.19 J107.12
JTDO  (via drill 0.3)
  Top 0.254: v97.99,124 97.99,119.5 93.49,115 93.49,106 96.99,102.5 v96.99,76.5
  Bottom 0.254: J111.9 65.97,77.25 68.89,77.25 69.64,76.5 v96.99,76.5 | v97.99,124 SHORT108.P2
JTDO_BL  (via drill 0.3)
  Top 0.254: v40.99,45 v40.99,29
  Bottom 0.254: SHORT105.P1 v40.99,29 | v40.99,45 52.49,45 53.76,46.27 J104.10 54.66,46.27 55.59,47.2 58.29,47.2 59.04,46.45 U104.4
JTDO_BR  (via drill 0.3)
  Top 0.254: v130.99,45 SHORT106.P1
  Bottom 0.254: v130.99,45 119.49,45 118.22,43.73 J105.10 117.37,43.73 116.44,42.8 113.69,42.8 112.94,43.55 U105.4
JTDO_CC  (via drill 0.3)
  Top 0.254: v85.99,124 v85.99,82.8 85.99,68.9 v87.94,66.95
  Bottom 0.254: v85.99,124 SHORT102.P1 | U101.4 v87.94,66.95 | v85.99,82.8 J101.10
JTDO_CL  (via drill 0.3)
  Top 0.254: v40.99,76 SHORT104.P1
  Bottom 0.254: v40.99,76 52.49,76 53.76,77.27 J103.10 54.66,77.27 55.59,78.2 58.29,78.2 59.04,77.45 U103.4
JTDO_CR  (via drill 0.3)
  Top 0.254: v130.99,76 SHORT107.P1
  Bottom 0.254: v130.99,76 119.49,76 118.22,74.73 J106.10 117.37,74.73 116.44,73.8 113.69,73.8 112.94,74.55 U106.4
JTDO_FL  (via drill 0.3)
  Top 0.254: v40.99,107 SHORT103.P1
  Bottom 0.254: v40.99,107 52.49,107 53.76,108.27 J102.10 54.61,108.27 55.54,109.2 58.29,109.2 59.04,108.45 U102.4
JTDO_FR  (via drill 0.3)
  Top 0.254: v130.99,107 v130.99,124
  Bottom 0.254: v130.99,107 119.49,107 118.22,105.73 J107.10 117.37,105.73 116.44,104.8 113.69,104.8 112.94,105.55 U107.4 | v130.99,124 SHORT108.P1
JTMS  (via drill 0.3)
  Top 0.254: v34.99,123.25 v34.99,112.1 v34.99,81.1 v34.99,50.15 | v133.24,123.25 v133.24,101.95 v133.24,70.95 v133.24,40 | v92.34,81.6 v92.34,75.75 | v98.74,123.25 98.74,119.2 94.24,114.7 94.24,106.35 97.74,102.85 v97.74,75.75
  Bottom 0.254: J111.7 65.97,74.71 68.62,74.71 69.66,75.75 v92.34,75.75 v97.74,75.75 | v34.99,123.25 v98.74,123.25 v133.24,123.25 | J107.14 118.24,100.65 119.54,101.95 v133.24,101.95 | J106.14 118.29,69.65 119.59,70.95 v133.24,70.95 | J105.14 118.24,38.65 119.59,40 v133.24,40 | J102.14 53.74,113.35 52.49,112.1 v34.99,112.1 | J103.14 53.74,82.35 52.49,81.1 v34.99,81.1 | J104.14 53.74,51.35 52.54,50.15 v34.99,50.15 | J101.14 v92.34,81.6
MISO  (via drill 0.3)
  Top 0.254: v37.24,121 v37.24,108.27 v37.24,77.27 v37.24,46.27 | v135.49,121 v135.49,105.73 v135.49,74.73 v135.49,43.73 | v88.54,89.2 v88.54,73.5 | v99.99,73.5 99.99,102.95 100.99,103.95 v100.99,121
  Bottom 0.254: J111.6 68.56,70.92 71.14,73.5 v88.54,73.5 v99.99,73.5 | v37.24,121 v100.99,121 v135.49,121 | v135.49,105.73 J107.9 | v135.49,74.73 J106.9 | v135.49,43.73 J105.9 | v37.24,108.27 J102.9 | v37.24,77.27 J103.9 | v37.24,46.27 J104.9 | J101.9 v88.54,89.2
MOSI  (via drill 0.3)
  Top 0.254: v35.74,122.5 v35.74,105.73 v35.74,74.73 v35.74,43.73 | v133.99,122.5 v133.99,108.27 v133.99,77.27 v133.99,46.27 | v98.49,75 98.49,103.15 94.99,106.65 94.99,114.4 99.49,118.9 v99.49,122.5 | v84.72,90.5 83.49,89.27 v83.49,75
  Bottom 0.254: v98.49,75 v83.49,75 70.21,75 68.67,73.46 J111.8 | v35.74,122.5 v99.49,122.5 v133.99,122.5 | v133.99,108.27 J107.7 | v133.99,77.27 J106.7 | v133.99,46.27 J105.7 | J102.7 v35.74,105.73 | v35.74,74.73 J103.7 | v35.74,43.73 J104.7 | J101.7 v84.72,90.5
N$1  (via drill 0.3)
  Top 0.254: TP201.P$1 v163.99,100
  Bottom 0.254: J201.1 151.99,120 163.99,108 v163.99,100
N$2  (via drill 0.3)
  Top 0.254: TP202.P$1 v163.99,96
  Bottom 0.254: J201.2 143.24,120 144.64,118.6 151.39,118.6 162.99,107 162.99,97 v163.99,96
N$3  (via drill 0.3)
  Top 0.254: TP205.P$1 v163.99,82
  Bottom 0.254: J203.1 156.99,89 v163.99,82
N$4  (via drill 0.3)
  Top 0.254: TP206.P$1 v163.99,78
  Bottom 0.254: J203.2 143.24,89 144.49,87.75 154.24,87.75 v163.99,78
N$5  (via drill 0.3)
  Top 0.254: TP203.P$1 v163.99,88
  Bottom 0.254: J202.1 143.24,94 145.74,91.5 160.49,91.5 v163.99,88
N$6  (via drill 0.3)
  Top 0.254: TP207.P$1 v163.99,74
  Bottom 0.254: J204.1 143.29,63 144.59,64.3 154.29,64.3 v163.99,74
N$7  (via drill 0.3)
  Top 0.254: TP204.P$1 v163.99,92
  Bottom 0.254: J202.2 161.99,94 v163.99,92
N$8  (via drill 0.3)
  Top 0.254: TP208.P$1 v163.99,70
  Bottom 0.254: J204.2 156.99,63 v163.99,70
N$9  (via drill 0.3)
  Top 0.254: TP209.P$1 v163.99,60
  Bottom 0.254: J205.1 161.99,58 v163.99,60
N$10  (via drill 0.3)
  Top 0.254: TP210.P$1 v163.99,64
  Bottom 0.254: J205.2 143.24,58 145.74,60.5 160.49,60.5 v163.99,64
N$11  (via drill 0.3)
  Top 0.254: TP211.P$1 v163.99,56
  Bottom 0.254: J206.1 144.09,33.3 151.29,33.3 162.99,45 162.99,55 v163.99,56
N$12  (via drill 0.3)
  Top 0.254: TP212.P$1 v163.99,52
  Bottom 0.254: J206.2 151.99,32 163.99,44 v163.99,52
N$13  (via drill 0.3)
  Top 0.254: TP213.P$1 v7.99,52
  Bottom 0.254: J207.1 19.99,32 7.99,44 v7.99,52
N$14  (via drill 0.3)
  Top 0.254: TP214.P$1 v7.99,56
  Bottom 0.254: J207.2 28.74,32 27.39,33.35 20.64,33.35 8.99,45 8.99,55 v7.99,56
N$15  (via drill 0.3)
  Top 0.254: TP215.P$1 v7.99,64
  Bottom 0.254: J208.1 28.74,58 26.24,60.5 11.49,60.5 v7.99,64
N$16  (via drill 0.3)
  Top 0.254: TP216.P$1 v7.99,60
  Bottom 0.254: J208.2 9.99,58 v7.99,60
N$17  (via drill 0.3)
  Top 0.254: TP217.P$1 v7.99,70
  Bottom 0.254: J209.1 14.99,63 v7.99,70
N$18  (via drill 0.3)
  Top 0.254: TP218.P$1 v7.99,74
  Bottom 0.254: v7.99,74 17.69,64.3 27.44,64.3 28.74,63 J209.2
N$19  (via drill 0.3)
  Top 0.254: TP219.P$1 v7.99,78
  Bottom 0.254: v7.99,78 17.74,87.75 27.49,87.75 28.74,89 J210.1
N$20  (via drill 0.3)
  Top 0.254: TP220.P$1 v7.99,82
  Bottom 0.254: J210.2 14.99,89 v7.99,82
N$21  (via drill 0.3)
  Top 0.254: TP221.P$1 v7.99,92
  Bottom 0.254: J211.1 9.99,94 v7.99,92
N$22  (via drill 0.3)
  Top 0.254: TP222.P$1 v7.99,88
  Bottom 0.254: v7.99,88 11.49,91.5 26.24,91.5 28.74,94 J211.2
N$23  (via drill 0.3)
  Top 0.254: TP223.P$1 v7.99,96
  Bottom 0.254: v7.99,96 8.99,97 8.99,107 20.79,118.8 27.54,118.8 28.74,120 J212.1
N$24  (via drill 0.3)
  Top 0.254: TP224.P$1 v7.99,100
  Bottom 0.254: J212.2 19.99,120 7.99,108 v7.99,100
N$25  (via drill 0.3)
  Top 0.254: TP225.P$1 v62.49,117
  Bottom 0.254: v62.49,117 65.29,114.2 J213.1
N$26  (via drill 0.3)
  Top 0.254: TP226.P$1 60.49,121 v60.49,117
  Bottom 0.254: v60.49,117 69.69,107.8 J213.2
N$27  (via drill 0.3)
  Top 0.254: TP227.P$1 111.49,121 v111.49,117
  Bottom 0.254: v111.49,117 102.29,107.8 J214.1
N$28  (via drill 0.3)
  Top 0.254: TP228.P$1 v109.49,117
  Bottom 0.254: v109.49,117 106.69,114.2 J214.2
NCS_BL  (via drill 0.3)
  Top 0.254: J110.11 106.02,77.24 106.02,74.97 106.29,74.7 107.79,74.7 110.74,71.75 110.74,60.75 v105.99,56
  Bottom 0.254: v105.99,56 50.34,56 48.23,53.89 J104.15
NCS_BR  (via drill 0.3)
  Top 0.254: J110.10 111.24,72.02 111.24,52.75 111.99,52 v111.99,34
  Bottom 0.254: v111.99,34 121.64,34 123.75,36.11 J105.15
NCS_CC
  Bottom 0.254: J110.17 97.48,86.16 94.88,88.76 J101.15
NCS_CL
  Bottom 0.254: J110.15 98.37,83.62 95.99,86 74.99,86 72.99,88 51.34,88 48.23,84.89 J103.15
NCS_CR  (via drill 0.3)
  Top 0.254: J110.12 111.99,73.81 v111.99,67
  Bottom 0.254: v111.99,67 114.99,67 115.99,66 122.64,66 123.75,67.11 J106.15
NCS_FL  (via drill 0.3)  (1 unrouted)
  Top 0.254: 105.92,82.28 108.22,82.28 108.99,83.05 108.99,115 v105.99,118
  Bottom 0.254: J102.15 48.23,115.89 50.34,118 v105.99,118
NCS_FR  (via drill 0.3)
  Top 0.254: J110.14 109.26,81.08 109.99,81.81 v109.99,99.5
  Bottom 0.254: v109.99,99.5 113.49,99.5 115.99,97 122.64,97 123.75,98.11 J107.15
NRST  (via drill 0.3)
  Top 0.254: v38.74,119.5 v38.74,113.35 v38.74,82.35 v38.74,51.35 | v136.99,119.5 v136.99,100.65 v136.99,69.65 v136.99,38.65 | v93.59,89.2 v93.59,72 | v101.49,72 101.49,102.45 102.49,103.45 v102.49,119.5
  Bottom 0.254: J111.2 73.42,72 v93.59,72 v101.49,72 | v38.74,119.5 v102.49,119.5 v136.99,119.5 | v136.99,100.65 J107.13 | v136.99,69.65 J106.13 | v136.99,38.65 J105.13 | J102.13 v38.74,113.35 | J103.13 v38.74,82.35 | v38.74,51.35 J104.13 | J101.13 v93.59,89.2
SCK  (via drill 0.3)
  Top 0.254: v37.99,120.25 v37.99,110.8 v37.99,79.81 v37.99,48.81 | v136.24,120.25 v136.24,103.19 v136.24,72.19 v136.24,41.19 | v91.09,89.2 v91.09,72.75 | v100.74,72.75 100.74,102.7 101.74,103.7 v101.74,120.25
  Bottom 0.254: J111.4 71.63,72.75 v91.09,72.75 v100.74,72.75 | v37.99,120.25 v101.74,120.25 v136.24,120.25 | v136.24,103.19 J107.11 | v136.24,72.19 J106.11 | v136.24,41.19 J105.11 | J102.11 v38,110.81 v37.99,110.8 | J103.11 v37.99,79.81 | J104.11 v37.99,48.81 | J101.11 v91.09,89.2
THYONE_CTS  (via drill 0.3)
  Top 0.254: J110.7 103.14,71.88 103.14,71.25 101.64,69.75 v99.99,69.75 | J109.15 v77.1,69.74 v77.09,69.75
  Bottom 0.254: v99.99,69.75 v77.09,69.75
THYONE_MAIN2THYONE  (via drill 0.3)
  Top 0.254: J110.9 102.65,73.92 102.65,71.45 101.69,70.5 v100.74,70.5 | v80.84,70.5 80.89,70.45 80.89,24.55 79.64,23.3 J109.14
  Bottom 0.254: v100.74,70.5 v80.84,70.5
THYONE_RTS  (via drill 0.3)
  Top 0.254: J110.16 105.88,85 103.99,85 102.19,83.2 102.19,71.95 v101.49,71.25 | J109.16 77.1,23.26 78.34,24.5 78.34,70.75 v77.84,71.25
  Bottom 0.254: v101.49,71.25 v77.84,71.25
THYONE_THYONE2MAIN  (via drill 0.3)
  Top 0.254: J110.8 105.97,72.17 105.97,70.18 105.44,69.65 102.89,69.65 102.24,69 v99.24,69 | J109.13 79.64,68.7 v79.34,69
  Bottom 0.254: v99.24,69 v79.34,69
VCC  (via drill 0.3)
  Top 0.61: v77.1,90.5 v77.1,97.99 v77.09,98
  Top 1.016: v45.99,98.11 v45.99,95.5 v45.99,67.11 v45.99,36.11 | v125.99,53.89 v125.99,62 v125.99,84.89 v125.99,95.5 v125.99,115.89 | J111.16 68.99,85.35 v68.99,98
  Bottom 0.61: J101.1 v77.1,90.5
  Bottom 0.813: J102.1 v45.99,98.11 | J103.1 v45.99,67.11 | J104.1 v45.99,36.11 | v125.99,115.89 J107.1 | J105.1 v125.99,53.89 | J106.1 v125.99,84.89
  Bottom 1.016: v45.99,95.5 56.99,95.5 59.49,98 v68.99,98 v77.09,98 111.99,98 114.49,95.5 v125.99,95.5 | J110.3 104.37,68.38 102.99,67 102.99,64 104.99,62 v125.99,62

### Text on the board
tPlace: Module Connector Pasta 04
bPlace: DO NOT CONNECT MODULE BOARDS FROM THIS SIDE! | DO NOT CONNECT MODULE BOARDS FROM THIS SIDE!